# Altium schematic sheet 4_WiFi.SchDoc: ESP8266-12E WiFi Controller
size A4; DrawnBy: Denis Cooper; Organization: felinefeast.org; Revision: 1.0; SheetNumber: 4; SheetTotal: 5
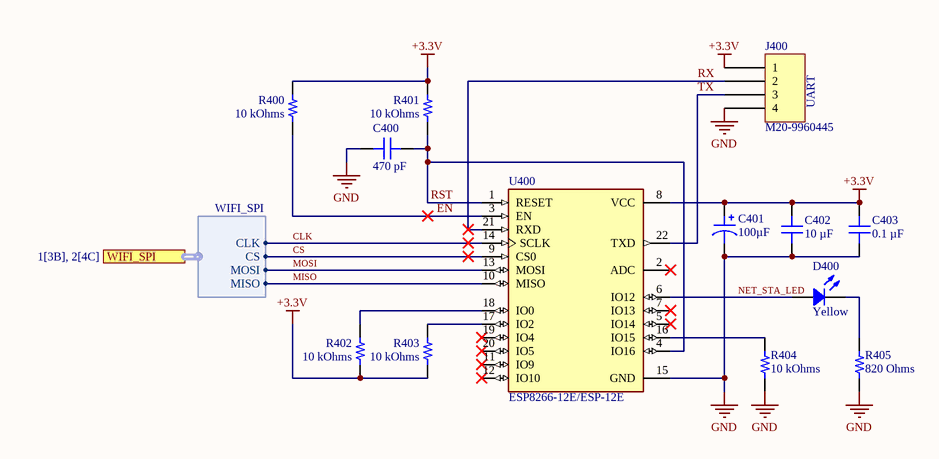
[diagram p0: 4_WiFi.SchDoc]

## Parts
C400  470 pF  [CAP 0603_1608]
C401  100µF  [CAP POL 2917_7343]
C402  10 µF  [CAP 0805_2012]
C403  0.1 µF  [CAP 0603_1608]
D400  Yellow  [LED 0603_1608 YELLOW]
J400  M20-9960445  [HARWIN M20-9960445]
R400  10 kOhms  [RES 0603_1608]
R401  10 kOhms  [RES 0603_1608]
R402  10 kOhms  [RES 0603_1608]
R403  10 kOhms  [RES 0603_1608]
R404  10 kOhms  [RES 0603_1608]
R405  820 Ohms  [RES 0603_1608]
U400  ESP8266-12E/ESP-12E  [XCVR_ESP8266-12E/ESP-12E]

## Ports
WIFI_SPI (harness WIFI_SPI, see 1[3B], 2[4C])

## Harnesses
WIFI_SPI: CLK, CS, MOSI, MISO

## Nets
+3.3V: C401.1 C402.1 C403.2 J400.1 R400.2 R401.2 R402.1 R403.1 U400.8(VCC)
GND: C400.1 C401.2 C402.2 C403.1 J400.4 R404.1 R405.1 U400.15(GND)
CLK: U400.14(SCLK) ; port WIFI_SPI.CLK
CS: U400.9(CS0) ; port WIFI_SPI.CS
EN: R400.1 U400.3(EN)
MISO: U400.10(MISO) ; port WIFI_SPI.MISO
MOSI: U400.13(MOSI) ; port WIFI_SPI.MOSI
NET_STA_LED: D400.1 U400.6(IO12)
RST: C400.2 R401.1 U400.1(RESET) U400.4(IO16)
RX: J400.2 U400.21(RXD)
TX: J400.3 U400.22(TXD)
NetD400_2: D400.2 R405.2
NetR402_2: R402.2 U400.18(IO0)
NetR403_2: R403.2 U400.17(IO2)
NetR404_2: R404.2 U400.16(IO15)

Not connected (* = marked no-connect by the designer): U400 2(ADC)* 5(IO14)* 7(IO13)* 11(IO9)* 12(IO10)* 19(IO4)* 20(IO5)*

## Notes on the sheet
- (near J400) UART

## Library data of the parts
C400 = CL10B471KB8NNNC: CAP CER 470PF 50V X7R 0603; manufacturer: Samsung Electro-Mechanics; Tolerance: ±10%; Part Number: CL10B471KB8NNNC; Capacitance: 470 pF; Applications: General Purpose; componentlink1description: Datasheet; componentlink1url: http://www.samsungsem.com/kr/support/product-search/mlcc/CL10B471KB8NNNC.jsp; componentlink2description: DigiKey Link; componentlink2url: https://www.digikey.com/en/products/detail/samsung-electro-mechanics/CL10B471KB8NNNC/3886752; Device Package: 0603 (1608 Metric); lastupdated: 09.02.2024 20:10:20; Lifecycle Status: Active; Minimum Order: 1; Mounting Type: Surface Mount, MLCC; Operating Temperature: -55°C ~ 125°C; Package / Case: 0603 (1608 Metric); packaging: TapeAndReel; partid: 9822; Part Status: Active; price: 0.01; series: CL; Size / Dimension: 0.063" L x 0.031" W (1.60mm x 0.80mm); Supplier 1: DigiKey; Supplier Part Number 1: 1276-1094-1-ND; Temperature Coefficient: X7R; Thickness (Max): 0.035" (0.90mm); value: 470 pF; Voltage - Rated: 50V
C401 = TAJD107K016RNJ: CAP TANT 100UF 10% 16V 2917; manufacturer: AVX Corporation; Manufacturer Size Code: D; ESR (Equivalent Series Resistance): 600mOhm; Type: Molded; Part Number: TAJD107K016RNJ; Value: 100µF; Capacitance: 100µF; componentlink1description: Datasheet; componentlink1url: http://datasheets.avx.com/TAJ.pdf; componentlink2description: DigiKey Link; componentlink2url: http://digikey.com/product-detail/en/avx-corporation/TAJD107K016RNJ/478-1723-1-ND/564755; Device Package: 2917 (7343 Metric); Features: General Purpose; Height - Seated (Max): 0.122" (3.10mm); lastupdated: 02.09.2020 1:16:19; Lifecycle Status: Active; Minimum Order: 1; Mounting Type: Surface Mount; Operating Temperature: -55°C ~ 125°C; Package / Case: 2917 (7343 Metric); packaging: TapeAndReel; partid: 1445; Part Status: Active; price: 0.35; series: TAJ; Size / Dimension: 0.287" L x 0.169" W (7.30mm x 4.30mm); Supplier 1: DigiKey; Supplier Part Number 1: 478-1723-1-ND; Tolerance: ±10%; Voltage - Rated: 16V
C402 = CL21B106KPQNNNE: CAP CER 10UF 10V X7R 0805; manufacturer: Samsung Electro-Mechanics; Tolerance: ±10%; Part Number: CL21B106KPQNNNE; Capacitance: 10 µF; Applications: General Purpose; componentlink1description: Datasheet; componentlink1url: http://www.samsungsem.com/kr/support/product-search/mlcc/CL21B106KPQNNNE.jsp; componentlink2description: DigiKey Link; componentlink2url: https://www.digikey.com/en/products/detail/samsung-electro-mechanics/CL21B106KPQNNNE/3887422; Device Package: 0805 (2012 Metric); lastupdated: 09.02.2024 20:15:41; Lifecycle Status: Active; Minimum Order: 1; Mounting Type: Surface Mount, MLCC; Operating Temperature: -55°C ~ 125°C; Package / Case: 0805 (2012 Metric); packaging: TapeAndReel; partid: 13130; Part Status: Active; price: 0.02; series: CL; Size / Dimension: 0.079" L x 0.049" W (2.00mm x 1.25mm); Supplier 1: DigiKey; Supplier Part Number 1: 1276-1764-1-ND; Temperature Coefficient: X7R; Thickness (Max): 0.055" (1.40mm); value: 10 µF; Voltage - Rated: 10V
C403 = CL10B104KA8NNNC: CAP CER 0.1UF 25V X7R 0603; manufacturer: Samsung Electro-Mechanics; Tolerance: ±10%; Part Number: CL10B104KA8NNNC; Capacitance: 0.1 µF; Applications: General Purpose; componentlink1description: Datasheet; componentlink1url: http://www.samsungsem.com/kr/support/product-search/mlcc/CL10B104KA8NNNC.jsp; componentlink2description: DigiKey Link; componentlink2url: https://www.digikey.com/en/products/detail/samsung-electro-mechanics/CL10B104KA8NNNC/3886664; Device Package: 0603 (1608 Metric); lastupdated: 09.02.2024 20:10:20; Lifecycle Status: Active; Minimum Order: 1; Mounting Type: Surface Mount, MLCC; Operating Temperature: -55°C ~ 125°C; Package / Case: 0603 (1608 Metric); packaging: TapeAndReel; partid: 9793; Part Status: Active; price: 0.01; series: CL; Size / Dimension: 0.063" L x 0.031" W (1.60mm x 0.80mm); Supplier 1: DigiKey; Supplier Part Number 1: 1276-1006-1-ND; Temperature Coefficient: X7R; Thickness (Max): 0.035" (0.90mm); value: 0.1 µF; Voltage - Rated: 25V
D400 = LY L29K-H1K2-26-Z: LED YELLOW DIFFUSED 0603 SMD; Manufacturer: OSRAM Opto Semiconductors Inc.; Configuration: Standard; Current - Test: 2mA; Lens Color: White; Lens Size: 1.30mm x 0.80mm; Lens Style: Rectangle with Flat Top; Millicandela Rating: 7mcd; Viewing Angle: 160°; Voltage - Forward (Vf) (Typ): 1.8V; Wavelength - Dominant: 587nm; Wavelength - Peak: 591nm; Part Number: LY L29K-H1K2-26-Z; Color: Yellow; ComponentLink1Description: Datasheet; ComponentLink1URL: https://dammedia.osram.info/media/resource/hires/osram-dam-2492957/LY%20L29K.pdf; ComponentLink2Description: DigiKey Link; ComponentLink2URL: https://www.digikey.com/en/products/detail/osram-opto-semiconductors-inc/LY-L29K-H1K2-26-Z/810340; Device Package: 0603 (1608 Metric); Height (Max): 0.65mm; LastUpdated: 03.06.2024 20:01:09; Lens Transparency: Diffused; Lifecycle Status: Active; Minimum Order: 1; Mounting Type: Surface Mount; Package / Case: 0603 (1608 Metric); Packaging: TapeAndReel; PartId: 140; Part Status: Active; Price: 0.07; Series: SMARTLED® 0603; Size / Dimension: 1.70mm L x 0.80mm W; Supplier 1: DigiKey; Supplier Part Number 1: 475-1196-1-ND; Supplier Device Package: 0603; Value: Yellow
J400 = M20-9960445: CONN HEADER R/A 4POS 2.54MM; Manufacturer: Harwin Inc.; Connector Type: Header, Cuttable; Contact Length - Mating: 0.240" (6.10mm); Contact Length - Post: 0.118" (3.00mm); Current Rating (Amps): 3A per Contact; Material Flammability Rating: UL94 V-0; Number of Positions: 4; Number of Positions Loaded: All; Pitch - Mating: 0.100" (2.54mm); Row Spacing - Mating: -40°C ~ 105°C; Shrouding: Unshrouded; Style: Board to Board or Cable; Part Number: M20-9960445; ComponentLink1Description: Datasheet; ComponentLink1URL: https://cdn.harwin.com/pdfs/Harwin_PC_Connectors_M20.pdf; ComponentLink2Description: DigiKey Link; ComponentLink2URL: https://www.digikey.com/en/products/detail/harwin-inc/M20-9960445/3921052; Contact Finish - Mating: Gold; Contact Material: Brass; Contact Shape: Square; Contact Type: Male Pin; Fastening Type: Push-Pull; Insulation Color: Black; Insulation Height: 0.100" (2.54mm); Insulation Material: Polyamide (PA6T), Nylon 6T; LastUpdated: 21.09.2022 19:23:20; Lifecycle Status: Active; Minimum Order: 1; Mounting Type: Through Hole, Right Angle; Number of Rows: 1; Operating Temperature: -40°C ~ 105°C; Packaging: Bulk; PartId: 167; Part Status: Active; Price: 0.11; Series: M20; Supplier 1: DigiKey; Supplier Part Number 1: 952-3286-ND; Termination: Solder
R400-R404 = ERJ-P03F1002V: RES SMD 10 KOHM 1% 1/5W 0603; Manufacturer: Panasonic Electronic Components; Power (Watts): 0.2W, 1/5W; Temperature Coefficient: ±200ppm/°C; Part Number: ERJ-P03F1002V; Value: 10 kOhms; ComponentLink1Description: Datasheet; ComponentLink1URL: https://industrial.panasonic.com/cdbs/www-data/pdf/RDO0000/AOA0000C331.pdf; ComponentLink2Description: DigiKey Link; ComponentLink2URL: https://www.digikey.com/en/products/detail/panasonic-electronic-components/ERJ-P03F1002V/9810215; Composition: Thick Film; Device Package: 0603 (1608 Metric); Features: Automotive AEC-Q200, Pulse Withstanding; Height - Seated (Max): 0.022" (0.55mm); LastUpdated: 09.02.2024 20:40:33; Lifecycle Status: Active; Minimum Order: 1; Number of Terminations: 2; Operating Temperature: -55°C ~ 155°C; Package / Case: 0603 (1608 Metric); Packaging: TapeAndReel; PartId: 82212; Price: 0.03; Ratings: AEC-Q200; Resistance: 10 kOhms; Series: ERJ-P03; Size / Dimension: 0.063" L x 0.031" W (1.60mm x 0.80mm); Supplier 1: DigiKey; Supplier Part Number 1: 10-ERJ-P03F1002VCT-ND; Supplier Device Package: 0603; Tolerance: ±1%
R405 = ERJ-3EKF8200V: RES SMD 820 OHM 1% 1/10W 0603; Manufacturer: Panasonic Electronic Components; Power (Watts): 0.1W, 1/10W; Temperature Coefficient: ±100ppm/°C; Part Number: ERJ-3EKF8200V; Value: 820 Ohms; ComponentLink1Description: Datasheet; ComponentLink1URL: https://industrial.panasonic.com/cdbs/www-data/pdf/RDA0000/AOA0000C304.pdf; ComponentLink2Description: DigiKey Link; ComponentLink2URL: https://www.digikey.com/en/products/detail/panasonic-electronic-components/ERJ-3EKF8200V/1746447; Composition: Thick Film; Device Package: 0603 (1608 Metric); Features: Automotive AEC-Q200; Height - Seated (Max): 0.022" (0.55mm); LastUpdated: 09.02.2024 20:41:57; Lifecycle Status: Active; Minimum Order: 1; Number of Terminations: 2; Operating Temperature: -55°C ~ 155°C; Package / Case: 0603 (1608 Metric); Packaging: TapeAndReel; PartId: 25993; Part Status: Active; Price: 0.01; Ratings: AEC-Q200; Resistance: 820 Ohms; Series: ERJ-3EK; Size / Dimension: 0.063" L x 0.031" W (1.60mm x 0.80mm); Supplier 1: DigiKey; Supplier Part Number 1: P820HCT-ND; Supplier Device Package: 0603; Tolerance: ±1%
U400 = ESP8266-12E/ESP-12E: This WiFi module has a 32-bit MCU micro and clock speeds supporting 80 MHz or 160 MHz. Supports the RTOS and integrated Wi-Fi MAC/BB/RF/PA/LNA, and has an on-board antenna.; MF: AI-Thinker; Value: *; SnapEDA_Link: https://www.snapeda.com/parts/ESP8266-12E/ESP-12E/AI-Thinker/view-part/?ref=snap; Availability: Not in stock; Price: None; Package: None; Check_prices: https://www.snapeda.com/parts/ESP8266-12E/ESP-12E/AI-Thinker/view-part/?ref=eda; MP: ESP8266-12E/ESP-12E